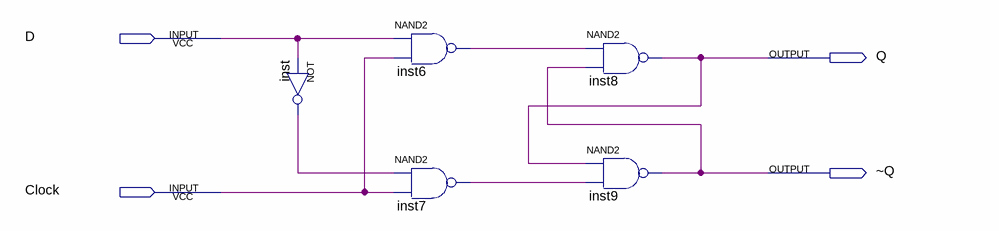
[diagram p0: schematic sheet]
// Quartus schematic lab9step2.bdf as structural Verilog: 5 symbols, 4 pins
module lab9step2 (
  input  D,
  input  Clock,
  output Q,
  output \~Q 
);

  wire inst6_out, inst7_out, inst_out;

  not inst (inst_out, D);
  nand inst6 (inst6_out, D, Clock);
  nand inst7 (inst7_out, inst_out, Clock);
  nand inst8 (Q, inst6_out, \~Q );
  nand inst9 (\~Q , Q, inst7_out);
endmodule
